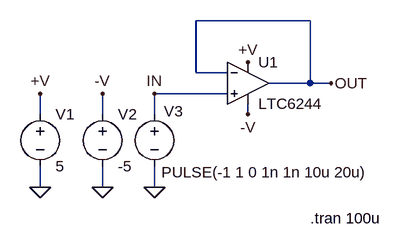
[diagram p0: schematic 6244HV.asc]
6244HV.asc, the LTspice schematic file:
Version 4
SHEET 1 880 680
WIRE 384 256 208 256
WIRE 208 336 208 256
WIRE 256 336 208 336
WIRE 384 352 384 256
WIRE 384 352 320 352
WIRE 416 352 384 352
WIRE 256 368 144 368
WIRE -32 400 -32 368
WIRE 64 400 64 368
WIRE 144 400 144 368
WIRE 288 400 288 384
WIRE -32 512 -32 480
WIRE 64 512 64 480
WIRE 144 512 144 480
FLAG -32 512 0
FLAG 64 512 0
FLAG -32 368 +V
FLAG 144 512 0
FLAG 144 368 IN
FLAG 416 352 OUT
FLAG 288 320 +V
FLAG 64 368 -V
FLAG 288 400 -V
SYMBOL voltage -32 384 R0
SYMATTR InstName V1
SYMATTR Value 5
SYMBOL voltage 64 384 R0
SYMATTR InstName V2
SYMATTR Value -5
SYMBOL LTC6244 288 352 R0
SYMATTR InstName U1
SYMBOL voltage 144 384 R0
WINDOW 0 15 11 Left 0
WINDOW 3 11 105 Left 0
SYMATTR InstName V3
SYMATTR Value PULSE(-1 1 0 1n 1n 10u 20u)
TEXT 384 560 Left 0 !.tran 100u

The netlist it stands for:
* 6244HV.asc
V1 +V 0 5
V2 -V 0 -5
XU1 IN OUT +V -V OUT LTC6244  ; pins In+ In- V+ V- OUT
V3 IN 0 PULSE(-1 1 0 1n 1n 10u 20u)
.tran 100u
.backanno
.end